# Altium schematic sheet ACC_ICM20948.SchDoc
size A; SheetNumber: 2
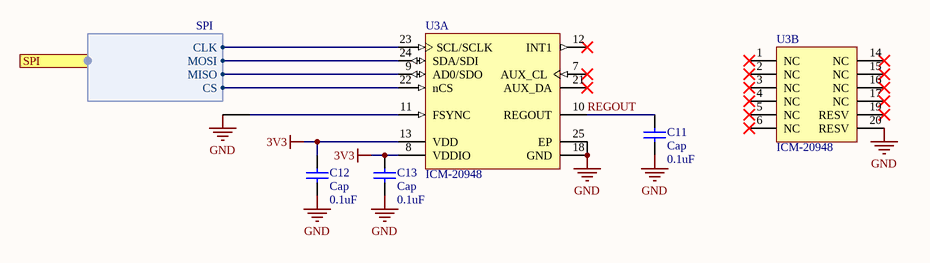
[diagram p0: ACC_ICM20948.SchDoc]

## Parts
C11  Cap  value 0.1uF  [CAPC1005N]
C12  Cap  value 0.1uF  [CAPC1005N]
C13  Cap  value 0.1uF  [CAPC1005N]
U3  ICM-20948  [TDK-QFN-24_M]  (parts A,B of 2)

## Ports
SPI (harness SPI)

## Harnesses
SPI: MOSI, MISO, CS, CLK

## Nets
3V3: C12.2 C13.2 U3.8(VDDIO) U3.13(VDD)
GND: C11.1 C12.1 C13.1 U3.11(FSYNC) U3.18(GND) U3.20(RESV) U3.25(EP)
REGOUT: C11.2 U3.10(REGOUT)
NetU3_9: U3.9(AD0/SDO) ; port SPI.MISO
NetU3_22: U3.22(nCS) ; port SPI.CS
NetU3_23: U3.23(SCL/SCLK) ; port SPI.CLK
NetU3_24: U3.24(SDA/SDI) ; port SPI.MOSI

Not connected (* = marked no-connect by the designer): U3 1(NC)* 2(NC)* 3(NC)* 4(NC)* 5(NC)* 6(NC)* 7(AUX_CL)* 12(INT1)* 14(NC)* 15(NC)* 16(NC)* 17(NC)* 19(RESV)* 21(AUX_DA)*

## Library data of the parts
C11-C13 = Cap: Capacitor; Published: 8-Jun-2000; LatestRevisionDate: 17-Jul-2002; LatestRevisionNote: Re-released for DXP Platform.; PackageReference: RAD-0.3; Publisher: Altium Limited; PackageDescription: Radial Cap, Thru-Hole; 2 Leads; 0.3 in Pin Spacing
U3 = CMP-2000-07532-1: World’s Lowest Power 9-Axis MEMS MotionTracking(TM) Device, 1.71 to 3.6 V, -40 to 85 degC, 24-Pin QFN, RoHS, Tape and Reel; Manufacturer: TDK; Package Description: 24-Pin Quad Flat No-lead Package, Body 3 x 3 mm, Pitch 0.4 mm; Datasheet Version: Rev. 1.3, 06/2017; Package Reference: QFN-24; Mounting Technology: SurfaceMount; Datasheet URL: https://www.invensense.com/wp-content/uploads/2016/06/DS-000189-ICM-20948-v1.3.pdf; Manufacturer URL: http://www.tdk.com/